# Altium schematic sheet Github_Test.SchDoc
size 863 x 558 mm
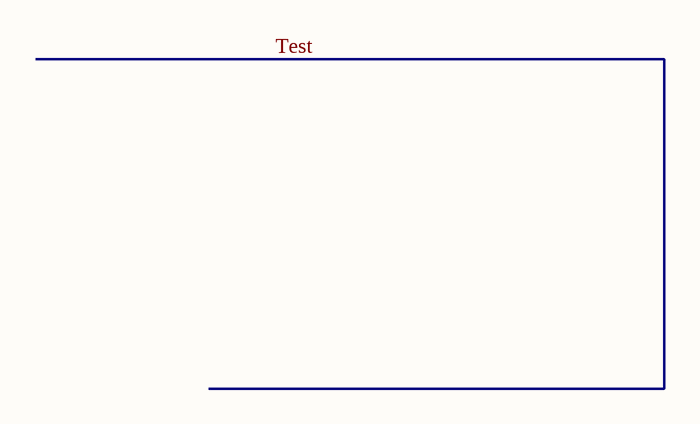
[diagram p0: Github_Test.SchDoc]

## Notes on the sheet
- 8
- 7
- 6
- 5
- 4
- 3
- 2
- 1
- REVISION HISTORY
- SEE SHEET 1
- D
- C
- B
- NAME
- DATE
- MM/DD/YY
- FERMI NATIONAL ACCELERATOR LABORATORY
- A
- ORIGINATOR
- DRAWN
- UNITED STATES DEPARTMENT OF ENERGY
- CHECKED
- APPROVED
- TITLE
- ALL SHEETS ARE MAINTAINED
- UNLESS OTHERWISE SPECIFIED
- AT THE SAME REVISION LEVEL
- SIZE
- DATE OF PRINT
- DRAWING NUMBER
- REV
- USED ON:
- SCALE     NONE
- SOFTWARE:  Altium Designer    v
- SHEET
- of